# EAGLE design Typhon v0.2 (EAGLE 5.11)
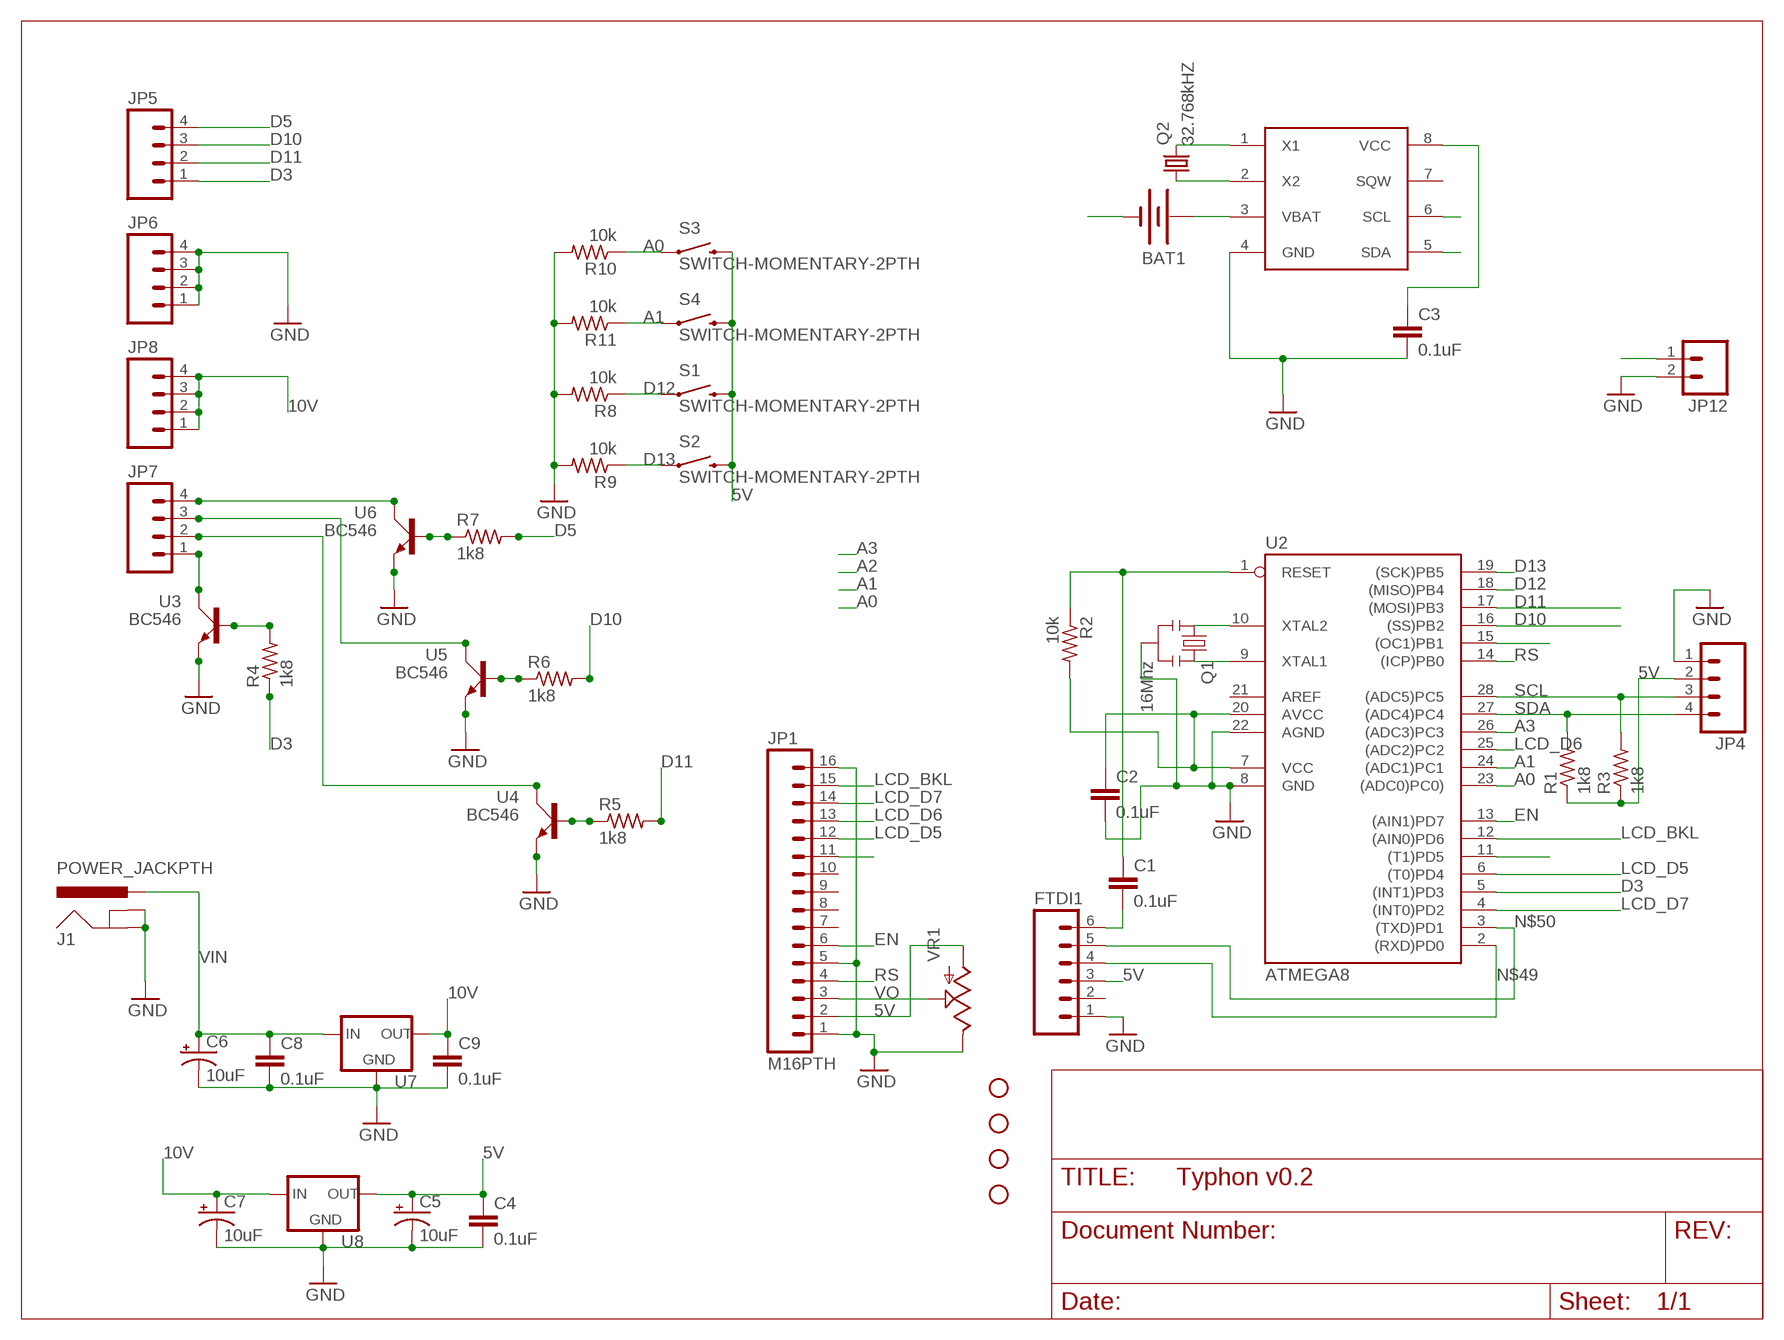
[diagram p0: schematic, sheet 1]

## Parts
BAT1  BATTERY12PTH_KEYSTONE  [BATT_12MM_KEYSTONE]
C1  0.1uF  CAPPTH  [CAP-PTH-SMALL]
C2  0.1uF  CAPPTH  [CAP-PTH-SMALL]
C3  0.1uF  CAPPTH  [CAP-PTH-SMALL]
C4  0.1uF  CAPPTH  [CAP-PTH-SMALL]
C5  10uF  CAP_POL6.3MMPTH  [CAP6.3MM2.5MM]
C6  10uF  CAP_POL6.3MMPTH  [CAP6.3MM2.5MM]
C7  10uF  CAP_POL6.3MMPTH  [CAP6.3MM2.5MM]
C8  0.1uF  CAPPTH  [CAP-PTH-SMALL]
C9  0.1uF  CAPPTH  [CAP-PTH-SMALL]
FTDI1  M06SIP  [1X06]
J1  POWER_JACKPTH  [POWER_JACK_PTH]
JP1  M16PTH  [1X16]
JP2  STAND-OFF  [STAND-OFF]
JP3  STAND-OFF  [STAND-OFF]
JP4  M04PTH  [1X04]
JP5  M04PTH  [1X04]
JP6  M04PTH  [1X04]
JP7  M04PTH  [1X04]
JP8  M04PTH  [1X04]
JP9  STAND-OFF  [STAND-OFF]
JP10  STAND-OFF  [STAND-OFF]
JP12  M02PTH  [1X02]
Q1  16Mhz  RESONATORPTH  [RESONATOR-PTH]
Q2  32.768kHZ  CRYSTALTC26H  [TC26H]
R1  1k8  R-US_0204/5  [0204/5]
R2  10k  R-US_0204/7  [0204/7]
R3  1k8  R-US_0204/5  [0204/5]
R4  1k8  R-US_0204/7  [0204/7]
R5  1k8  R-US_0204/7  [0204/7]
R6  1k8  R-US_0204/7  [0204/7]
R7  1k8  R-US_0204/7  [0204/7]
R8  10k  R-US_0204/7  [0204/7]
R9  10k  R-US_0204/7  [0204/7]
R10  10k  R-US_0204/7  [0204/7]
R11  10k  R-US_0204/7  [0204/7]
S1  SWITCH-MOMENTARY-2PTH  [TACTILE-PTH]
S2  SWITCH-MOMENTARY-2PTH  [TACTILE-PTH]
S3  SWITCH-MOMENTARY-2PTH  [TACTILE-PTH]
S4  SWITCH-MOMENTARY-2PTH  [TACTILE-PTH]
U1  DS1307DS1307  [DIP08]
U2  ATMEGA8  AT90S4433P  [DIL28-3]
U3  BC546  [TO92-]
U4  BC546  [TO92-]
U5  BC546  [TO92-]
U6  BC546  [TO92-]
U7  V_REG_78XX  [TO220AHV]
U8  V_REG_78XX  [TO220AHV]
VR1  POT  [TRIM_POT_SIDE]

## Nets
5V [Power]: C2.1 C3.1 C4.1 C5.P$2(+) FTDI1.3 JP1.2 JP4.2 R1.1 R2.2 R3.1 S1.3 S2.3 S3.3 S4.3 U1.8(VCC) U2.7(VCC) U2.20(AVCC) U8.E(OUT) VR1.P$3(A)
10V [Power]: C7.P$2(+) C9.1 JP8.1 JP8.2 JP8.3 JP8.4 U7.E(OUT) U8.B(IN)
A0: R10.1 S3.1 U2.23((ADC0)PC0))
A1: R11.1 S4.1 U2.24((ADC1)PC1)
A3: U2.26((ADC3)PC3)
D3: JP5.1 R4.1 U2.5((INT1)PD3)
D5: JP5.4 R7.2 U2.11((T1)PD5)
D10: JP5.3 R6.2 U2.16((SS)PB2)
D11: JP5.2 R5.2 U2.17((MOSI)PB3)
D12: R8.1 S1.1 U2.18((MISO)PB4)
D13: R9.1 S2.1 U2.19((SCK)PB5)
EN: JP1.6 U2.13((AIN1)PD7)
GND [Power]: BAT1.GND(-) C2.2 C3.2 C4.2 C5.P$1(-) C6.P$1(-) C7.P$1(-) C8.2 C9.2 FTDI1.1 J1.GND J1.GNDBREAK JP1.1 JP1.5 JP1.16 JP4.1 JP6.1 JP6.2 JP6.3 JP6.4 JP12.2 Q1.2 R8.2 R9.2 R10.2 R11.2 U1.4(GND) U2.8(GND) U2.22(AGND) U3.3(E) U4.3(E) U5.3(E) U6.3(E) U7.C(GND) U8.C(GND) VR1.P$1(E)
LCD_BKL: JP1.15 U2.12((AIN0)PD6)
LCD_D5: JP1.12 U2.6((T0)PD4)
LCD_D6: JP1.13 U2.25((ADC2)PC2)
LCD_D7: JP1.14 U2.4((INT0)PD2)
LCD_D9: JP1.11 U2.15((OC1)PB1)
N$1: Q2.1 U1.2(X2)
N$2: Q2.2 U1.1(X1)
N$3: BAT1.V+(+) U1.3(VBAT)
N$5: JP7.1 U3.1(C)
N$6: R4.2 U3.2(B)
N$9: C1.1 R2.1 U2.1(RESET)
N$18: R7.1 U6.2(B)
N$19: JP7.4 U6.1(C)
N$20: R5.1 U4.2(B)
N$21: R6.1 U5.2(B)
N$22: JP7.3 U5.1(C)
N$23: JP7.2 U4.1(C)
N$36: Q1.3 U2.9(XTAL1)
N$38: Q1.1 U2.10(XTAL2)
N$49: FTDI1.4 U2.2((RXD)PD0)
N$50: FTDI1.5 U2.3((TXD)PD1)
N$51: C1.2 FTDI1.6
RS: JP1.4 U2.14((ICP)PB0)
SCL: JP4.3 R3.2 U1.6(SCL) U2.28((ADC5)PC5)
SDA: JP4.4 R1.2 U1.5(SDA) U2.27((ADC4)PC4)
VIN [Power]: C6.P$2(+) C8.1 J1.PWR JP12.1 U7.B(IN)
VO: JP1.3 VR1.P$2(S)
Unconnected: FTDI1.2 JP1.7 JP1.8 JP1.9 JP1.10 U1.7(SQW) U2.21(AREF)

## Library data of the parts
BAT1 = _allyourbase:BATTERY: Battery Holders Various common sizes : AA, AAA, 20mm coin cell and 12mm coin cell.
C1-C4 C8 C9 = _allyourbase:CAP: Capacitor Standard 0603 ceramic capacitor, and 0.1" leaded capacitor.
C5-C7 = _allyourbase:CAP_POL: Capacitor Polarized These are standard SMD and PTH capacitors. Normally 10uF, 47uF, and 100uF in electrolytic and tantalum varieties. Always verify the external diameter of the through hole cap, it varies with capacity, voltage, and manufacturer. The EIA devices should be standard.
FTDI1 = _allyourbase:M06: Header 6 Standard 6-pin 0.1" header. Use with straight break away headers (SKU : PRT-00116), right angle break away headers (PRT-00553), swiss pins (PRT-00743), machine pins (PRT-00117), and female headers (PRT-00115). Molex polarized connector foot print use with SKU : PRT-08094 with associated crimp pins and housings. NOTES ON THE VARIANTS LOCK and LOCK_LONGPADS... This footprint was designed to help hold the alignment of a through-hole component (i.e. 6-pin header) while soldering it into place. You may notice that each hole has been shifted either up or down by 0.005 of an inch from it's more standard position (which is a perfectly straight line). This slight alteration caused the pins (the squares in the middle) to touch the edges of the holes. Because they are alternating, it causes a "brace" to hold the component in place. 0.005 has proven to be the perfect amount of "off-center" position when using our standard breakaway headers. Although looks a little odd when you look at the bare footprint, once you have a header in there, the alteration is very hard to notice. Also, if you push a header all the way into place, it is covered up entirely on the bottom side. This idea of altering the position of holes to aid alignment will be further integrated into the Sparkfun Library for other footprints. It can help hold any component with 3 or more connection pins.
J1 = _allyourbase:POWER_JACK: Power Jack This is the standard 5.5mm barrel jack for power. The PTH is the most common, proven, reliable, footprint. All others are experimental. The Slot footprint only works if the mill layer is transmitted to the PCB fab house so be warned. Spark Fun Electronics SKU : PRT-00119. Mating wall wart : TOL-00298 (and others)
JP1 = _allyourbase:M16
JP2 JP3 JP9 JP10 = _allyourbase:STAND-OFF: Stand Off This is the mechanical footprint for a #4 phillips button head screw. Use the keepout ring to avoid running the screw head into surrounding components. SKU : PRT-00447
JP4-JP8 = _allyourbase:M04: Header 4 Standard 4-pin 0.1" header. Use with straight break away headers (SKU : PRT-00116), right angle break away headers (PRT-00553), swiss pins (PRT-00743), machine pins (PRT-00117), and female headers (PRT-00115). Molex polarized connector foot print use with SKU : PRT-08231 with associated crimp pins and housings.
JP12 = _allyourbase:M02: Header 2 Standard 2-pin 0.1" header. Use with straight break away headers (SKU : PRT-00116), right angle break away headers (PRT-00553), swiss pins (PRT-00743), machine pins (PRT-00117), and female headers (PRT-00115). Molex polarized connector foot print use with SKU : PRT-08233 with associated crimp pins and housings.
Q1 = _allyourbase:RESONATOR: Resonator Small SMD resonator. This is the itty bitty 10/20MHz resonators with built in caps. CSTCE10M0G55 and CSTCE20M0V53. Footprint has been reviewed closely but hasn't been tested yet.
Q2 = _allyourbase:CRYSTAL: CRYSTAL
R1-R11 = _allyourbase:R-US_: RESISTOR, American symbol
S1-S4 = _allyourbase:SWITCH-MOMENTARY-2
U1 = _allyourbase:DS1307
U2 = atmel:AT90S4433: MICROCONTROLLER 4 Kbytes FLASH 128 bytes SRAM 256 bytes EEPROM UART 6-channel 10 bit ADC
U3-U6 = _allyourbase:BC546
U7 U8 = _allyourbase:V_REG_78XX: Voltage Regulator Standard 7805 5V regulator. IGO (Input Ground Output). Spark Fun Electronics SKU : COM-00107
VR1 = _allyourbase:POT

## Net classes
0 default: width 0.254 mm, drill 0.508 mm
1 Power: width 0.305 mm, drill 0.508 mm

## Board
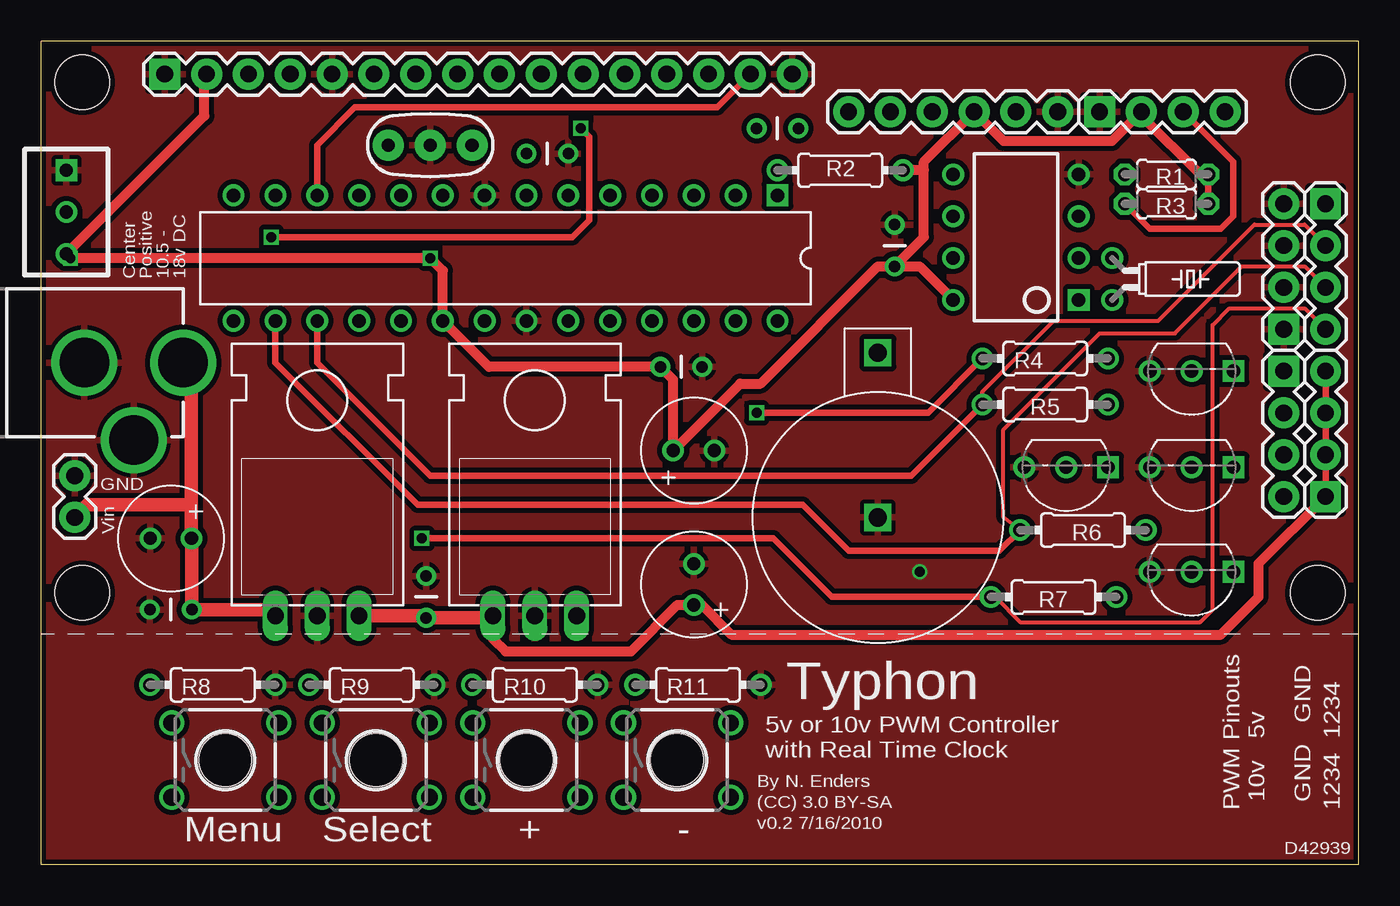
[diagram p1: board, top side]
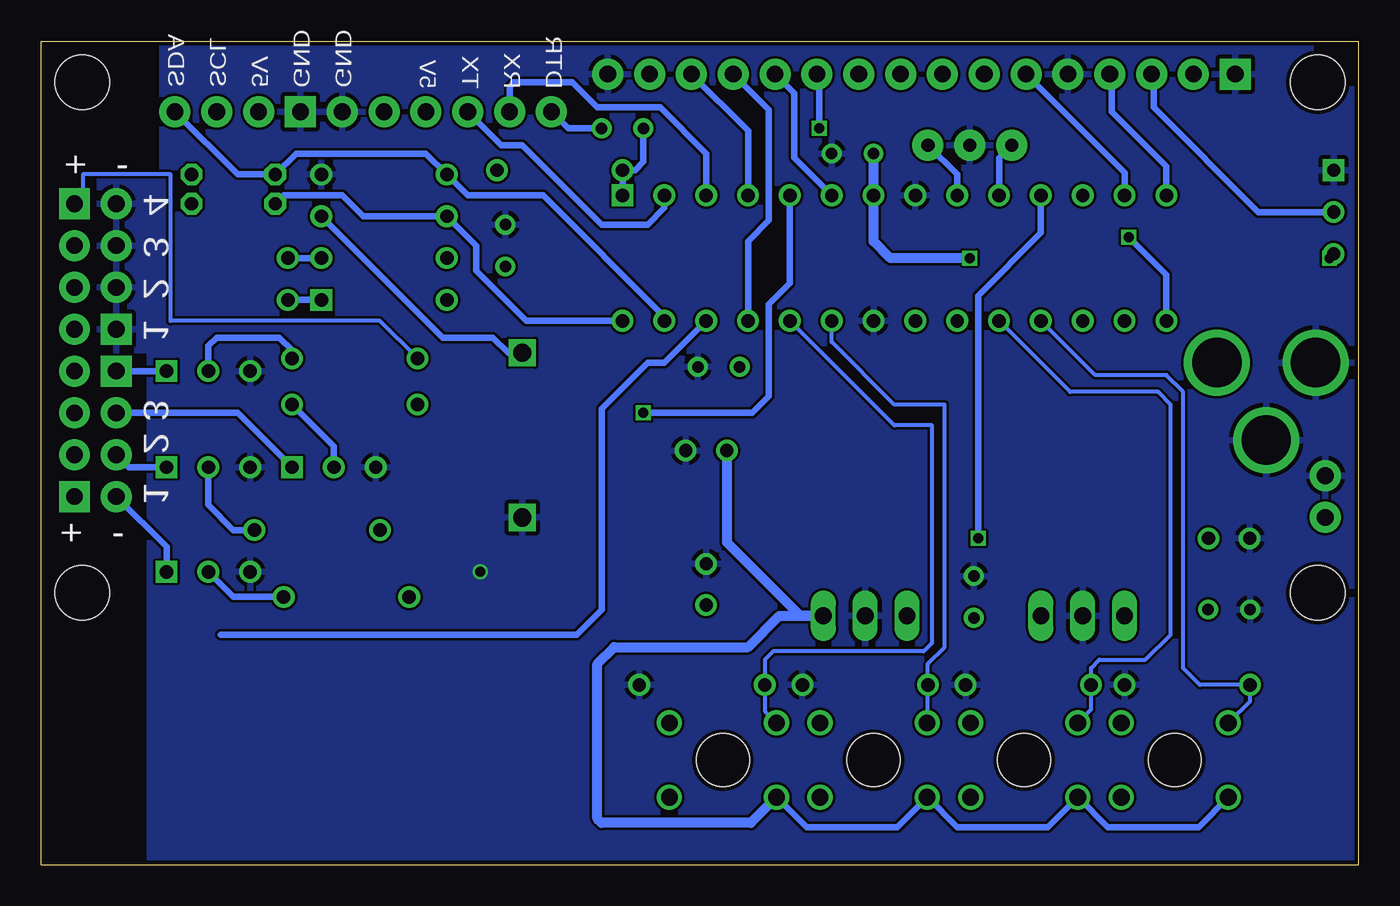
[diagram p2: board, bottom side, seen from below]

Size 80 x 50 mm. Coordinates in mm from the lower left corner, seen from the top.
Outline: 80,0 0,0 0,50 80,50 80,0
Copper layers (1*16): Top 0.035mm / dielectric 1.5mm / Bottom 0.035mm
Design rules "iTead-Seeed-DRC": minimum track width 6mil, minimum drill 12mil, track to track 6mil, track to pad 6mil, pad to pad 6mil, via to via 6mil, smd to smd 0mil, copper to edge 10mil, drill to drill 10mil, minimum pad ring 10mil, minimum via ring 6mil, stop-mask expansion 2mil, vias tented up to drill 100mil, thermal gap 10mil
Holes 3.2 mm at 11.18,6.35 20.32,6.35 29.46,6.35 38.61,6.35

### Footprints (pad centres in the part's own frame; a part is rotated, then mirrored left to right if it is on the bottom)
BATT_12MM_KEYSTONE = drill 1.1 square: GND 0,0; V+ 10,0
CAP-PTH-SMALL = drill 0.7 round: 1 0,0; 2 2.54,0
CAP6.3MM2.5MM = drill 0.8 round: P$1 -1.25,0; P$2 1.25,0
1X06 = drill 1.016 pad 1.88 round: 1 0,0; 2 2.54,0; 3 5.08,0; 4 7.62,0; 5 10.16,0; 6 12.7,0
POWER_JACK_PTH = drill 2.997 round: GND 0,7.7; GNDBREAK 4.7,10.7; PWR 0,13.7
1X16 = drill 1.016 pad 1.88 square: 1 0,0 | drill 1.016 pad 1.88 round: 2 2.54,0; 3 5.08,0; 4 7.62,0; 5 10.16,0; 6 12.7,0; 7 15.24,0; 8 17.78,0; 9 20.32,0; 10 22.86,0; 11 25.4,0; 12 27.94,0; 13 30.48,0; 14 33.02,0; 15 35.56,0; 16 38.1,0
STAND-OFF = hole 3.302: 0,0
1X04 = drill 1.016 pad 1.88 square: 1 0,0 | drill 1.016 pad 1.88 round: 2 2.54,0; 3 5.08,0; 4 7.62,0
1X02 = drill 1.016 pad 1.88 round: 1 0,0; 2 2.54,0
RESONATOR-PTH = drill 0.8 pad 1.88 round: 1 -2.54,0; 2 0,0; 3 2.54,0
TC26H = drill 0.813 round: 1 -1.27,0; 2 1.27,0
0204/5 = drill 0.813 octagon: 1 -2.54,0; 2 2.54,0
0204/7 = drill 0.813 round: 1 -3.81,0; 2 3.81,0
TACTILE-PTH = drill 1.016 round: 1 -3.251,2.261; 2 3.251,2.261; 3 -3.251,-2.261; 4 3.251,-2.261
DIP08 = drill 0.813 square: 1 -3.81,-3.81 | drill 0.813 round: 2 -1.27,-3.81; 3 1.27,-3.81; 4 3.81,-3.81; 5 3.81,3.81; 6 1.27,3.81; 7 -1.27,3.81; 8 -3.81,3.81
DIL28-3 = drill 0.813 square: 1 -16.51,-3.81 | drill 0.813 round: 2 -13.97,-3.81; 3 -11.43,-3.81; 4 -8.89,-3.81; 5 -6.35,-3.81; 6 -3.81,-3.81; 7 -1.27,-3.81; 8 1.27,-3.81; 9 3.81,-3.81; 10 6.35,-3.81; 11 8.89,-3.81; 12 11.43,-3.81; 13 13.97,-3.81; 14 16.51,-3.81; 15 16.51,3.81; 16 13.97,3.81; 17 11.43,3.81; 18 8.89,3.81; 19 6.35,3.81; 20 3.81,3.81; 21 1.27,3.81; 22 -1.27,3.81; 23 -3.81,3.81; 24 -6.35,3.81; 25 -8.89,3.81; 26 -11.43,3.81; 27 -13.97,3.81; 28 -16.51,3.81
TO92- = drill 0.813 square: 1 -2.54,0 | drill 0.813 round: 2 0,0; 3 2.54,0
TO220AHV = drill 1.016 long: B -2.54,-1.905; C 0,-1.905; E 2.54,-1.905
TRIM_POT_SIDE = drill 0.8 square: P$1 0,2.54 | drill 0.8 round: P$2 0,0; P$3 0,-2.54

### Placement (x,y rotation side)
BAT1  50.8,21.08 90 top
C1  43.43,44.7 0 top
C2  29.46,43.18 0 top
C3  51.82,36.32 90 top
C4  37.59,30.23 0 top
C5  39.62,25.15 180 top
C6  7.87,19.81 0 top
C7  39.62,17.02 270 top
C8  9.14,15.49 180 top
C9  23.37,14.99 90 top
FTDI1  61.72,45.72 180 top
J1  -5.08,30.48 270 top
JP1  7.5,48 0 top
JP2  2.5,47.5 0 top
JP3  77.5,47.5 0 top
JP4  64.26,45.72 0 top
JP5  77.98,40.13 270 top
JP6  75.44,32.51 90 top
JP7  75.44,29.97 270 top
JP8  77.98,22.35 90 top
JP9  2.5,16.5 0 top
JP10  77.5,16.5 0 top
JP12  2.03,21.08 90 top
Q1  23.62,43.69 0 top
Q2  65.02,35.56 270 top
R1  68.33,41.91 180 top
R2  48.51,42.16 0 top
R3  68.33,40.13 180 top
R4  60.96,30.73 0 top
R5  60.96,27.94 180 top
R6  63.25,20.32 180 top
R7  61.47,16.26 180 top
R8  10.41,10.92 0 top
R9  20.07,10.92 0 top
R10  29.97,10.92 0 top
R11  39.88,10.92 0 top
S1  11.18,6.35 0 top
S2  20.32,6.35 0 top
S3  29.46,6.35 0 top
S4  38.61,6.35 0 top
U1  59.18,38.1 90 top
U2  28.19,36.83 180 top
U3  69.85,29.97 180 top
U4  62.23,24.13 180 top
U5  69.85,24.13 180 top
U6  69.85,17.78 180 top
U7  16.76,17.02 0 top
U8  29.97,17.02 0 top
VR1  1.52,39.62 0 top

### Tracks (layer width: path | path; a pad name or v marks a point on that pad's centre or on a via)
5V  (via drill 0.6)
  Top 0.406: 9.91,47.87 JP1.2 | v38.35,25.13 C5.P$2 | R1.1 R3.1
  Top 0.61: VR1.P$3 9.91,45.47 9.91,47.87 | U1.8 53.34,36.32 C3.1 | C3.1 50.8,36.32 43.69,29.21 42.44,29.21 C5.P$2 38.37,29.44 C4.1 27.18,30.23 U2.20 24.38,36.07 v23.62,36.83 v1.78,36.83 | 53.59,42.16 53.59,38.1 C3.1 | 53.59,42.16 53.59,42.67 FTDI1.3 58.42,43.94 65.02,43.94 JP4.2 66.8,45.47 70.36,41.91 R1.1 | 53.59,42.16 R2.2
  Bottom 0.305: 35.05,3.81 S4.3
  Bottom 0.406: 35.33,4.09 35.05,3.81 33.53,2.29 28.02,2.29 S3.3 26.19,4.09 24.38,2.29 18.87,2.29 S2.3 17.04,4.09 15.24,2.29 9.73,2.29 S1.3
  Bottom 0.61: v38.35,25.13 38.35,19.56 33.91,15.11 U8.E 35.18,15.11 37.08,13.21 45.21,13.21 46.23,12.19 46.23,2.79 45.97,2.54 36.91,2.54 S4.3 | v1.78,36.83 VR1.P$3 | v23.62,36.83 28.45,36.83 29.46,37.85 U2.7 C2.1
10V
  Top 0.406: JP8.1 JP8.2 JP8.3 JP8.4
  Top 0.61: U8.B 27.43,13.72 28.19,12.95 35.81,12.95 38.63,15.77 C7.P$2 40.11,15.77 41.91,13.97 71.63,13.97 73.91,16.26 73.91,18.29 JP8.1
  Top 0.813: U7.E 23.24,15.11 C9.1 27.3,14.99 U8.B
A0
  Bottom 0.254: S3.1 26.16,8.66 R10.1 26.16,12.19 25.15,13.21 25.15,27.94 28.19,27.94 32,31.75 U2.23
A1
  Bottom 0.254: U2.24 28.19,26.67 25.91,26.67 25.91,13.46 26.42,12.95 35.56,12.95 36.07,12.45 R11.1 36.07,9.32 S4.1
A3
  Bottom 0.406: 69.09,13.97 47.5,13.97 45.97,15.49 45.97,27.69 43.18,30.48 42.16,30.48 U2.26
D3  (via drill 0.6)
  Top 0.406: v43.43,27.43 53.85,27.43 R4.1
  Bottom 0.254: R4.1 59.44,33.02 72.14,33.02 72.14,41.91 77.47,41.91 77.47,40.64 JP5.1
  Bottom 0.406: U2.5 34.54,35.31 35.81,34.04 35.81,28.45 36.83,27.43 v43.43,27.43
D5  (via drill 0.6)
  Top 0.254: JP5.4 76.71,33.78 72.14,33.78 71.12,32.77 71.12,15.49 70.36,14.73 59.44,14.73 57.91,16.26 R7.2
  Top 0.406: R7.2 48.01,16.26 44.45,19.81 v23.11,19.81
  Bottom 0.406: U2.11 19.3,38.35 23.11,34.54 v23.11,19.81
D10
  Top 0.254: JP5.3 76.71,36.32 72.9,36.32 68.83,32.26 64.26,32.26 58.42,26.42 58.42,21.08 R6.2
  Top 0.406: R6.2 58.17,19.05 49.02,19.05 46.23,21.84 22.86,21.84 14.22,30.48 U2.16
D11
  Top 0.254: R5.2 57.15,28.7 61.47,33.02 67.82,33.02 73.66,38.86 76.71,38.86 JP5.2
  Top 0.406: R5.2 52.83,23.62 23.62,23.62 16.76,30.48 U2.17
D12
  Bottom 0.254: U2.18 16,29.72 11.68,29.72 10.67,28.7 10.67,11.94 9.65,10.92 R8.1 6.6,9.93 S1.1
D13
  Bottom 0.254: U2.19 17.53,28.7 12.19,28.7 11.43,27.94 11.43,13.97 12.95,12.45 15.75,12.45 16.26,11.94 R9.1 16.26,9.42 S2.1
EN
  Bottom 0.406: U2.13 14.22,42.02 JP1.6
GND  (via drill 0.6)
  other vias: 53.34,17.78
  pour Top (isolate 0.305): 0,50.04 0,0 80.01,0 80.01,50.04
  pour Bottom: 0,0 73.41,0 73.41,31.24 76.45,31.24 76.45,41.66 72.64,41.66 72.64,50.04 0,50.04
LCD_BKL
  Top 0.406: U2.12 16.76,43.69 19.05,45.97 41.03,45.97 JP1.15
LCD_D5
  Bottom 0.406: U2.6 34.29,42.93 34.29,46.85 JP1.12
LCD_D6
  Bottom 0.406: U2.25 37.08,37.85 35.81,39.12 35.81,45.83 JP1.13
LCD_D7
  Bottom 0.406: U2.4 37.08,44.56 JP1.14
LCD_D9  (via drill 0.6)
  Top 0.406: v13.97,38.1 32.26,38.1 33.27,39.12 33.27,44.2 v32.77,44.7
  Bottom 0.406: U2.15 11.68,35.81 v13.97,38.1 | v32.77,44.7 32.77,47.87 JP1.11
N$1
  Bottom 0.406: U1.2 Q2.1
N$2
  Bottom 0.406: U1.1 Q2.2
N$3
  Bottom 0.406: BAT1.V+ 51.66,31.08 52.58,32 55.63,32 U1.3
N$5
  Bottom 0.406: U3.1 JP7.1
N$6
  Bottom 0.406: R4.2 64.77,31.24 65.53,32 69.34,32 69.85,31.5 U3.2
N$9
  Bottom 0.406: U2.1 R2.1 43.94,42.16 43.43,42.67 C1.1
N$18
  Bottom 0.406: R7.1 68.33,16.26 U6.2
N$19
  Bottom 0.406: U6.1 72.39,19.3 JP7.4
N$20
  Bottom 0.406: U4.2 62.23,25.4 R5.1
N$21
  Bottom 0.406: R6.1 68.33,20.32 69.85,21.84 U5.2
N$22
  Bottom 0.406: U5.1 74.68,24.13 JP7.3
N$23
  Bottom 0.406: U4.1 68.07,27.43 JP7.2
N$36
  Bottom 0.406: U2.9 24.38,41.91 Q1.3
N$38
  Bottom 0.406: U2.10 21.84,42.93 Q1.1
N$49
  Bottom 0.406: U2.2 42.16,39.88 43.18,38.86 45.97,38.86 50.8,43.69 52.07,43.69 FTDI1.4
N$50
  Bottom 0.406: U2.3 39.62,43.18 42.42,45.97 46.23,45.97 47.75,47.5 51.31,47.5 51.56,47.24 FTDI1.5
N$51
  Bottom 0.406: C1.2 48.01,44.7 FTDI1.6
RS
  Bottom 0.406: U2.14 11.68,42.42 14.99,45.72 14.99,47.87 JP1.4
SCL
  Top 0.406: JP4.3 72.39,42.67 72.39,39.37 71.63,38.61 67.31,38.61 R3.2
  Bottom 0.406: U2.28 50.55,33.02 53.59,36.07 53.59,37.59 U1.6 60.45,39.37 61.72,40.64 65.28,40.64 R3.2
SDA
  Bottom 0.406: U2.27 42.16,33.27 49.53,40.64 54.1,40.64 U1.5 56.64,43.18 64.52,43.18 R1.2 68.07,41.91 JP4.4
VIN
  Top 0.813: U7.B 13.84,15.49 C8.1 9.14,19.54 C6.P$2 9.12,21.84 | 9.12,21.84 9.12,29.98 J1.PWR | 9.12,21.84 2.79,21.84 JP12.1
VO
  Bottom 0.406: VR1.P$2 6.1,39.62 12.45,45.97 12.45,47.87 JP1.3

### Text on the board
tNames: Center | Positive | 10.5 - | 18v DC | GND | Vin | Typhon | 5v or 10v PWM Controller | with Real Time Clock | By N. Enders | 10v 5v | GND GND | (CC) 3.0 BY-SA | PWM Pinouts | 1234 1234 | v0.2 7/16/2010 | Menu | Select | + | - | D42939
bNames: DTR | RX | TX | 5V | GND | GND | 5V | SCL | SDA | - | + | 4 | 3 | 2 | 1 | 3 | 2 | 1 | - | +